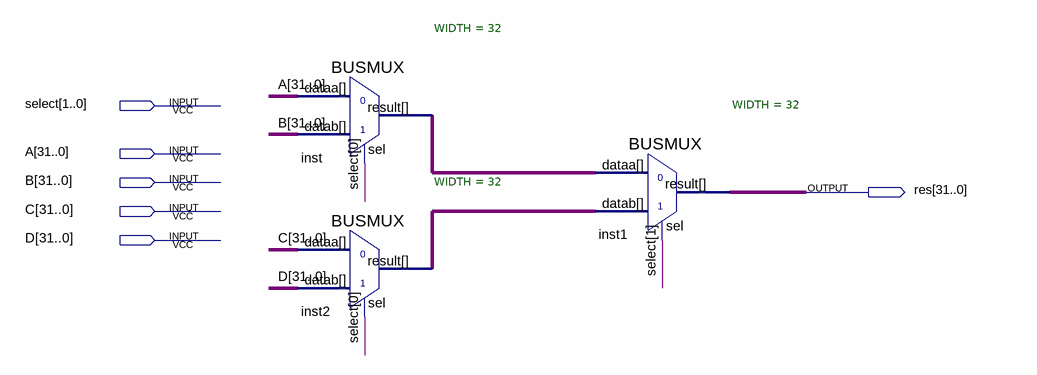
[diagram p0: schematic sheet]
// Quartus schematic mux4x.bdf as structural Verilog: 3 symbols, 6 pins
module mux4x (
  input  [1:0] select,
  input  [31:0] A,
  input  [31:0] B,
  input  [31:0] C,
  input  [31:0] D,
  output [31:0] res
);

  wire [31:0] inst2_result, inst_result;

  BUSMUX #(.WIDTH(32)) inst (.datab(B), .sel(select[0]), .dataa(A), .result(inst_result));
  BUSMUX #(.WIDTH(32)) inst2 (.datab(D), .sel(select[0]), .dataa(C), .result(inst2_result));
  BUSMUX #(.WIDTH(32)) inst1 (.datab(inst2_result), .sel(select[1]), .dataa(inst_result), .result(res));
endmodule
